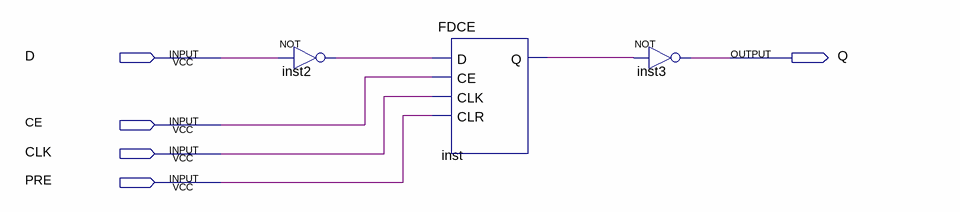
[diagram p0: schematic sheet]
// Quartus schematic FDPE.bdf as structural Verilog: 3 symbols, 5 pins
module FDPE (
  input  D,
  input  CE,
  input  CLK,
  input  PRE,
  output Q
);

  wire inst2_out, inst_q;

  not inst2 (inst2_out, D);
  FDCE inst (.D(inst2_out), .CE(CE), .CLK(CLK), .CLR(PRE), .Q(inst_q));
  not inst3 (Q, inst_q);
endmodule
